# Altium schematic sheet Power_Section.SchDoc
size A4; DocumentNumber: 4; SheetNumber: 4; SheetTotal: 6
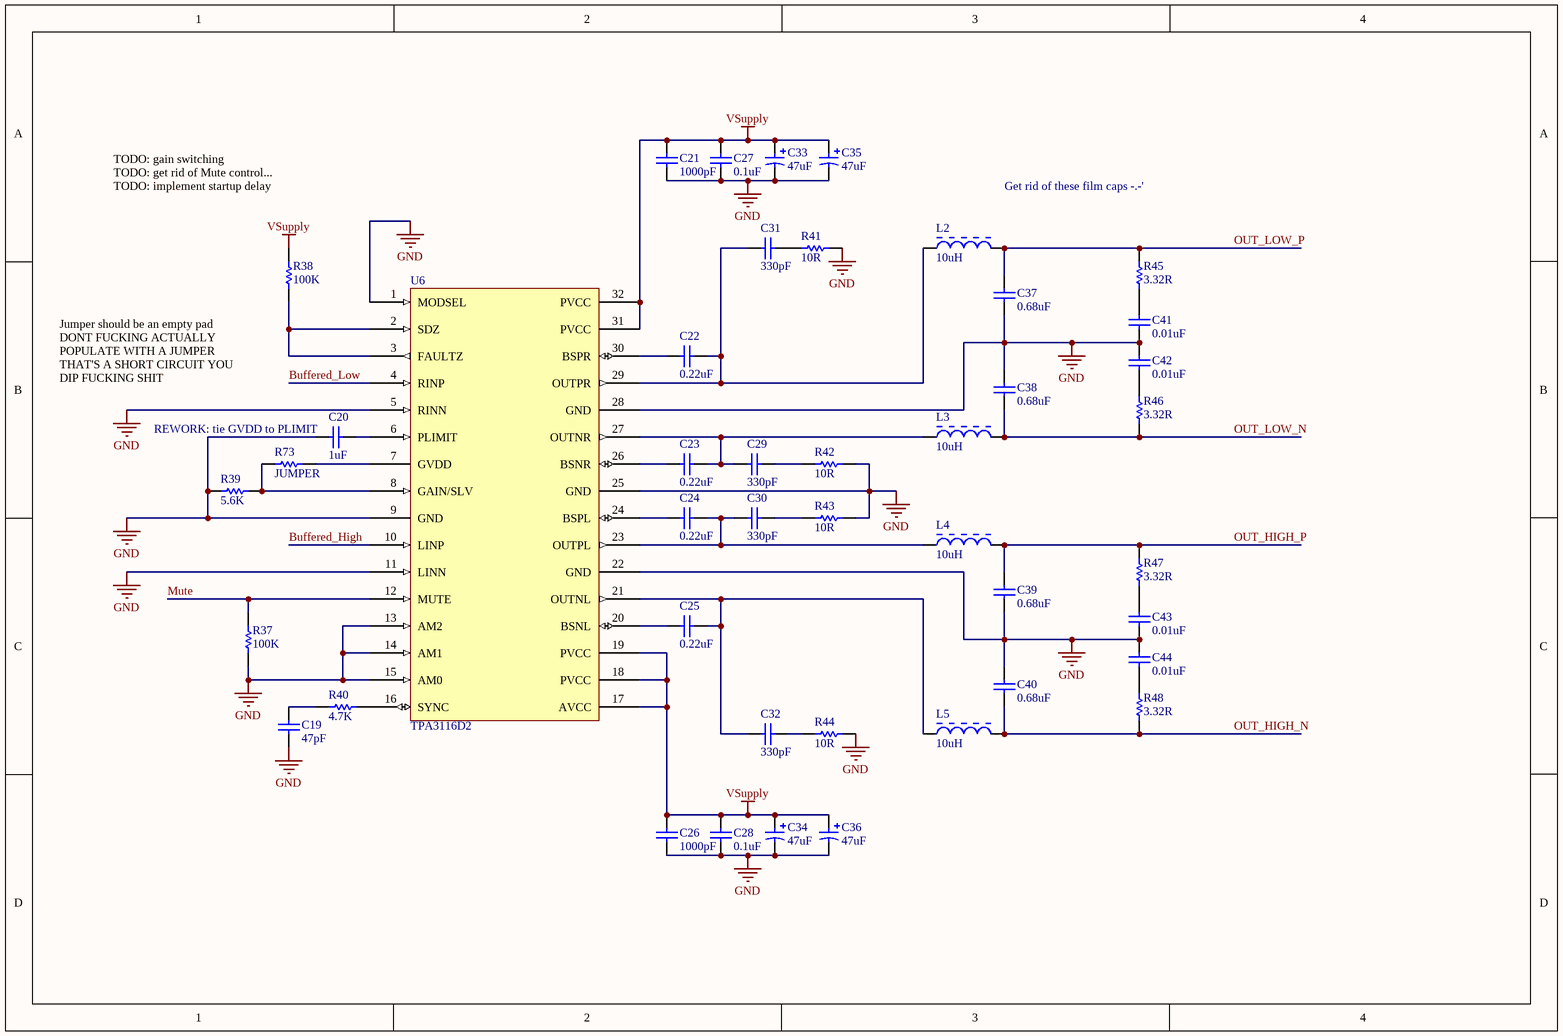
[diagram p0: Power_Section.SchDoc]

## Parts
C19  47pF  [CAPC1608X09N]
C20  1uF  [CAPC1608X09N]
C21  1000pF  [CAPC1608X09N]
C22  0.22uF  [CAPC1608X09N]
C23  0.22uF  [CAPC1608X09N]
C24  0.22uF  [CAPC1608X09N]
C25  0.22uF  [CAPC1608X09N]
C26  1000pF  [CAPC1608X09N]
C27  0.1uF  [CAPC1608X09N]
C28  0.1uF  [CAPC1608X09N]
C29  330pF  [CAPC1608X09N]
C30  330pF  [CAPC1608X09N]
C31  330pF  [CAPC1608X09N]
C32  330pF  [CAPC1608X09N]
C33  47uF  [CAP_EEFK_D]
C34  47uF  [CAP_EEFK_D]
C35  47uF  [CAP_EEFK_D]
C36  47uF  [CAP_EEFK_D]
C37  0.68uF  [CAP Radial 5mm]
C38  0.68uF  [CAP Radial 5mm]
C39  0.68uF  [CAP Radial 5mm]
C40  0.68uF  [CAP Radial 5mm]
C41  0.01uF  [CAPC1608X09N]
C42  0.01uF  [CAPC1608X09N]
C43  0.01uF  [CAPC1608X09N]
C44  0.01uF  [CAPC1608X09N]
L2  10uH  [IND_BOURNS_SRN10]
L3  10uH  [IND_BOURNS_SRN10]
L4  10uH  [IND_BOURNS_SRN10]
L5  10uH  [IND_BOURNS_SRN10]
R37  100K  [RESC1608X06N]
R38  100K  [RESC1608X06N]
R39  5.6K  [RESC1608X06N]
R40  4.7K  [RESC1608X06N]
R41  10R  [RESC2012X06N]
R42  10R  [RESC2012X06N]
R43  10R  [RESC2012X06N]
R44  10R  [RESC2012X06N]
R45  3.32R  [RESC1608X06N]
R46  3.32R  [RESC1608X06N]
R47  3.32R  [RESC1608X06N]
R48  3.32R  [RESC1608X06N]
R73  JUMPER  [RESC1608X06N]
U6  TPA3116D2  [DAP0032A]

## Nets
GND: C19.1 C20.1 C21.1 C26.1 C27.1 C28.1 C33.2 C34.2 C35.2 C36.2 C37.1 C38.2 C39.1 C40.2 C41.1 C42.2 C43.1 C44.2 R37.1 R39.2 R41.2 R42.2 R43.2 R44.2 U6.1(MODSEL) U6.5(RINN) U6.9(GND) U6.11(LINN) U6.13(AM2) U6.14(AM1) U6.15(AM0) U6.22(GND) U6.25(GND) U6.28(GND) U6.33(POWERPAD)
VSupply: C21.2 C26.2 C27.2 C28.2 C33.1 C34.1 C35.1 C36.1 R38.2 U6.17(AVCC) U6.18(PVCC) U6.19(PVCC) U6.31(PVCC) U6.32(PVCC)
Buffered_High: U6.10(LINP)
Buffered_Low: U6.4(RINP)
Mute: R37.2 U6.12(MUTE)
OUT_HIGH_N: C40.1 L5.2 R48.1
OUT_HIGH_P: C39.2 L4.2 R47.2
OUT_LOW_N: C38.1 L3.2 R46.1
OUT_LOW_P: C37.2 L2.2 R45.2
NetC19_2: C19.2 R40.1
NetC20_2: C20.2 U6.6(PLIMIT)
NetC22_1: C22.1 U6.30(BSPR)
NetC22_2: C22.2 C31.1 L2.1 U6.29(OUTPR)
NetC23_1: C23.1 U6.26(BSNR)
NetC23_2: C23.2 C29.1 L3.1 U6.27(OUTNR)
NetC24_1: C24.1 U6.24(BSPL)
NetC24_2: C24.2 C30.1 L4.1 U6.23(OUTPL)
NetC25_1: C25.1 U6.20(BSNL)
NetC25_2: C25.2 C32.1 L5.1 U6.21(OUTNL)
NetC29_2: C29.2 R42.1
NetC30_2: C30.2 R43.1
NetC31_2: C31.2 R41.1
NetC32_2: C32.2 R44.1
NetC41_2: C41.2 R45.1
NetC42_1: C42.1 R46.2
NetC43_2: C43.2 R47.1
NetC44_1: C44.1 R48.2
NetR38_1: R38.1 U6.2(SDZ) U6.3(FAULTZ)
NetR39_1: R39.1 R73.1 U6.8(GAIN/SLV)
NetR40_2: R40.2 U6.16(SYNC)
NetR73_2: R73.2 U6.7(GVDD)

## Notes on the sheet
- TODO: gain switching
- TODO: get rid of Mute control...
- TODO: implement startup delay
- Get rid of these film caps -.-'
- (near R38) Jumper should be an empty pad
  DONT FUCKING ACTUALLY POPULATE WITH A JUMPER THAT'S A SHORT CIRCUIT YOU DIP FUCKING SHIT
- REWORK: tie GVDD to PLIMIT

## Library data of the parts
C19 = CAP CER 47pF 0603: Rating: C0G; Voltage: 50V; Value: 47pF; Digikey Part Number: 490-1419-1-ND
C20 = CAP CER 1uF 0603: Voltage: 35V; Value: 1uF; Digikey Part Number: 490-10487-1-ND
C21 C26 = CAP CER 1000pF 0603: Manufacturer: Murata; Rating: C0G; Voltage: 50V; Value: 1000pF; Digikey Part Number: 490-1451-1-ND
C22-C25 = CAP CER 0.22uF 0603: Manufacturer: Murata; Voltage: 50V; Rating: X7R; Value: 0.22uF; Digikey Part Number: 490-5402-1-ND
C27 C28 = CAP CER 0.1uF 0603: Voltage: 100V; Rating: X7R; Tolerance: 10%; Value: 0.1uF; Digikey Part Number: 490-3285-1-ND; Package: 0603
C29-C32 = CAP CER 330pF 0603: Manufacturer: Murata; Rating: C0G; Voltage: 50V; Value: 330pF; Digikey Part Number: 490-1439-1-ND
C33-C36 = CAP ALUM 47uF SMD: Manufacturer: Panasonic; Voltage: 35V; Digikey Part Number: PCE3842CT-ND; Value: 47uF
C37-C40 = CAP 0.68uF Radial 5mm: Output Cap; Manufacturer: EPCOS (TDK); Voltage: 63V; Value: 0.68uF; Digikey Part Number: 495-1114-ND
C41-C44 = CAP CER 0.01uF 0603: Manufacturer: Murata; Rating: C0G; Value: 0.01uF; Digikey Part Number: 490-9666-1-ND
L2-L5 = IND 10uH 5A SMD: Digikey Part Number: SRN1060-100MCT-ND; Value: 10uH
R37 R38 = RES 100K 0603: Tolerance: 1%; Power: 0.1W; Footprint: 0603; Value: 100K; Digikey Part Number: 311-100KHRCT-ND
R39 = RES 5.6K 0603: Tolerance: 1%; Type: RES; Footprint: 0603; Value: 5.6K; Digikey Part Number: 311-5.60KHRCT-ND
R40 = RES 4.7K 0603: Tolerance: 1%; Type: RES; Footprint: 0603; Value: 4.7K; Digikey Part Number: 311-4.70KHRCT-ND
R41-R44 = RES 10R 0805: Tolerance: 1%; Power: 0.25W; Type: RES; Footprint: 0805; Digikey Part Number: RNCP0805FTD10R0CT-ND; Value: 10R
R45-R48 = RES 3.32R 0603: Tolerance: 1%; Power: 0.1W; Type: RES; Footprint: 0603; Digikey Part Number: 311-3.32HRCT-ND; Value: 3.32R
R73 = RES JUMPER 0603: Tolerance: 1%; Power: 0.25W; Type: RES; Footprint: 0603; Temperature: 155dC; Value: JUMPER; Digikey Part Number: 311-0.0GRCT-ND
U6 = TPA3116D2: Digikey Part Number: 296-39337-1-ND